# Altium project ISEPIC Cartridge for C64.PrjPcb
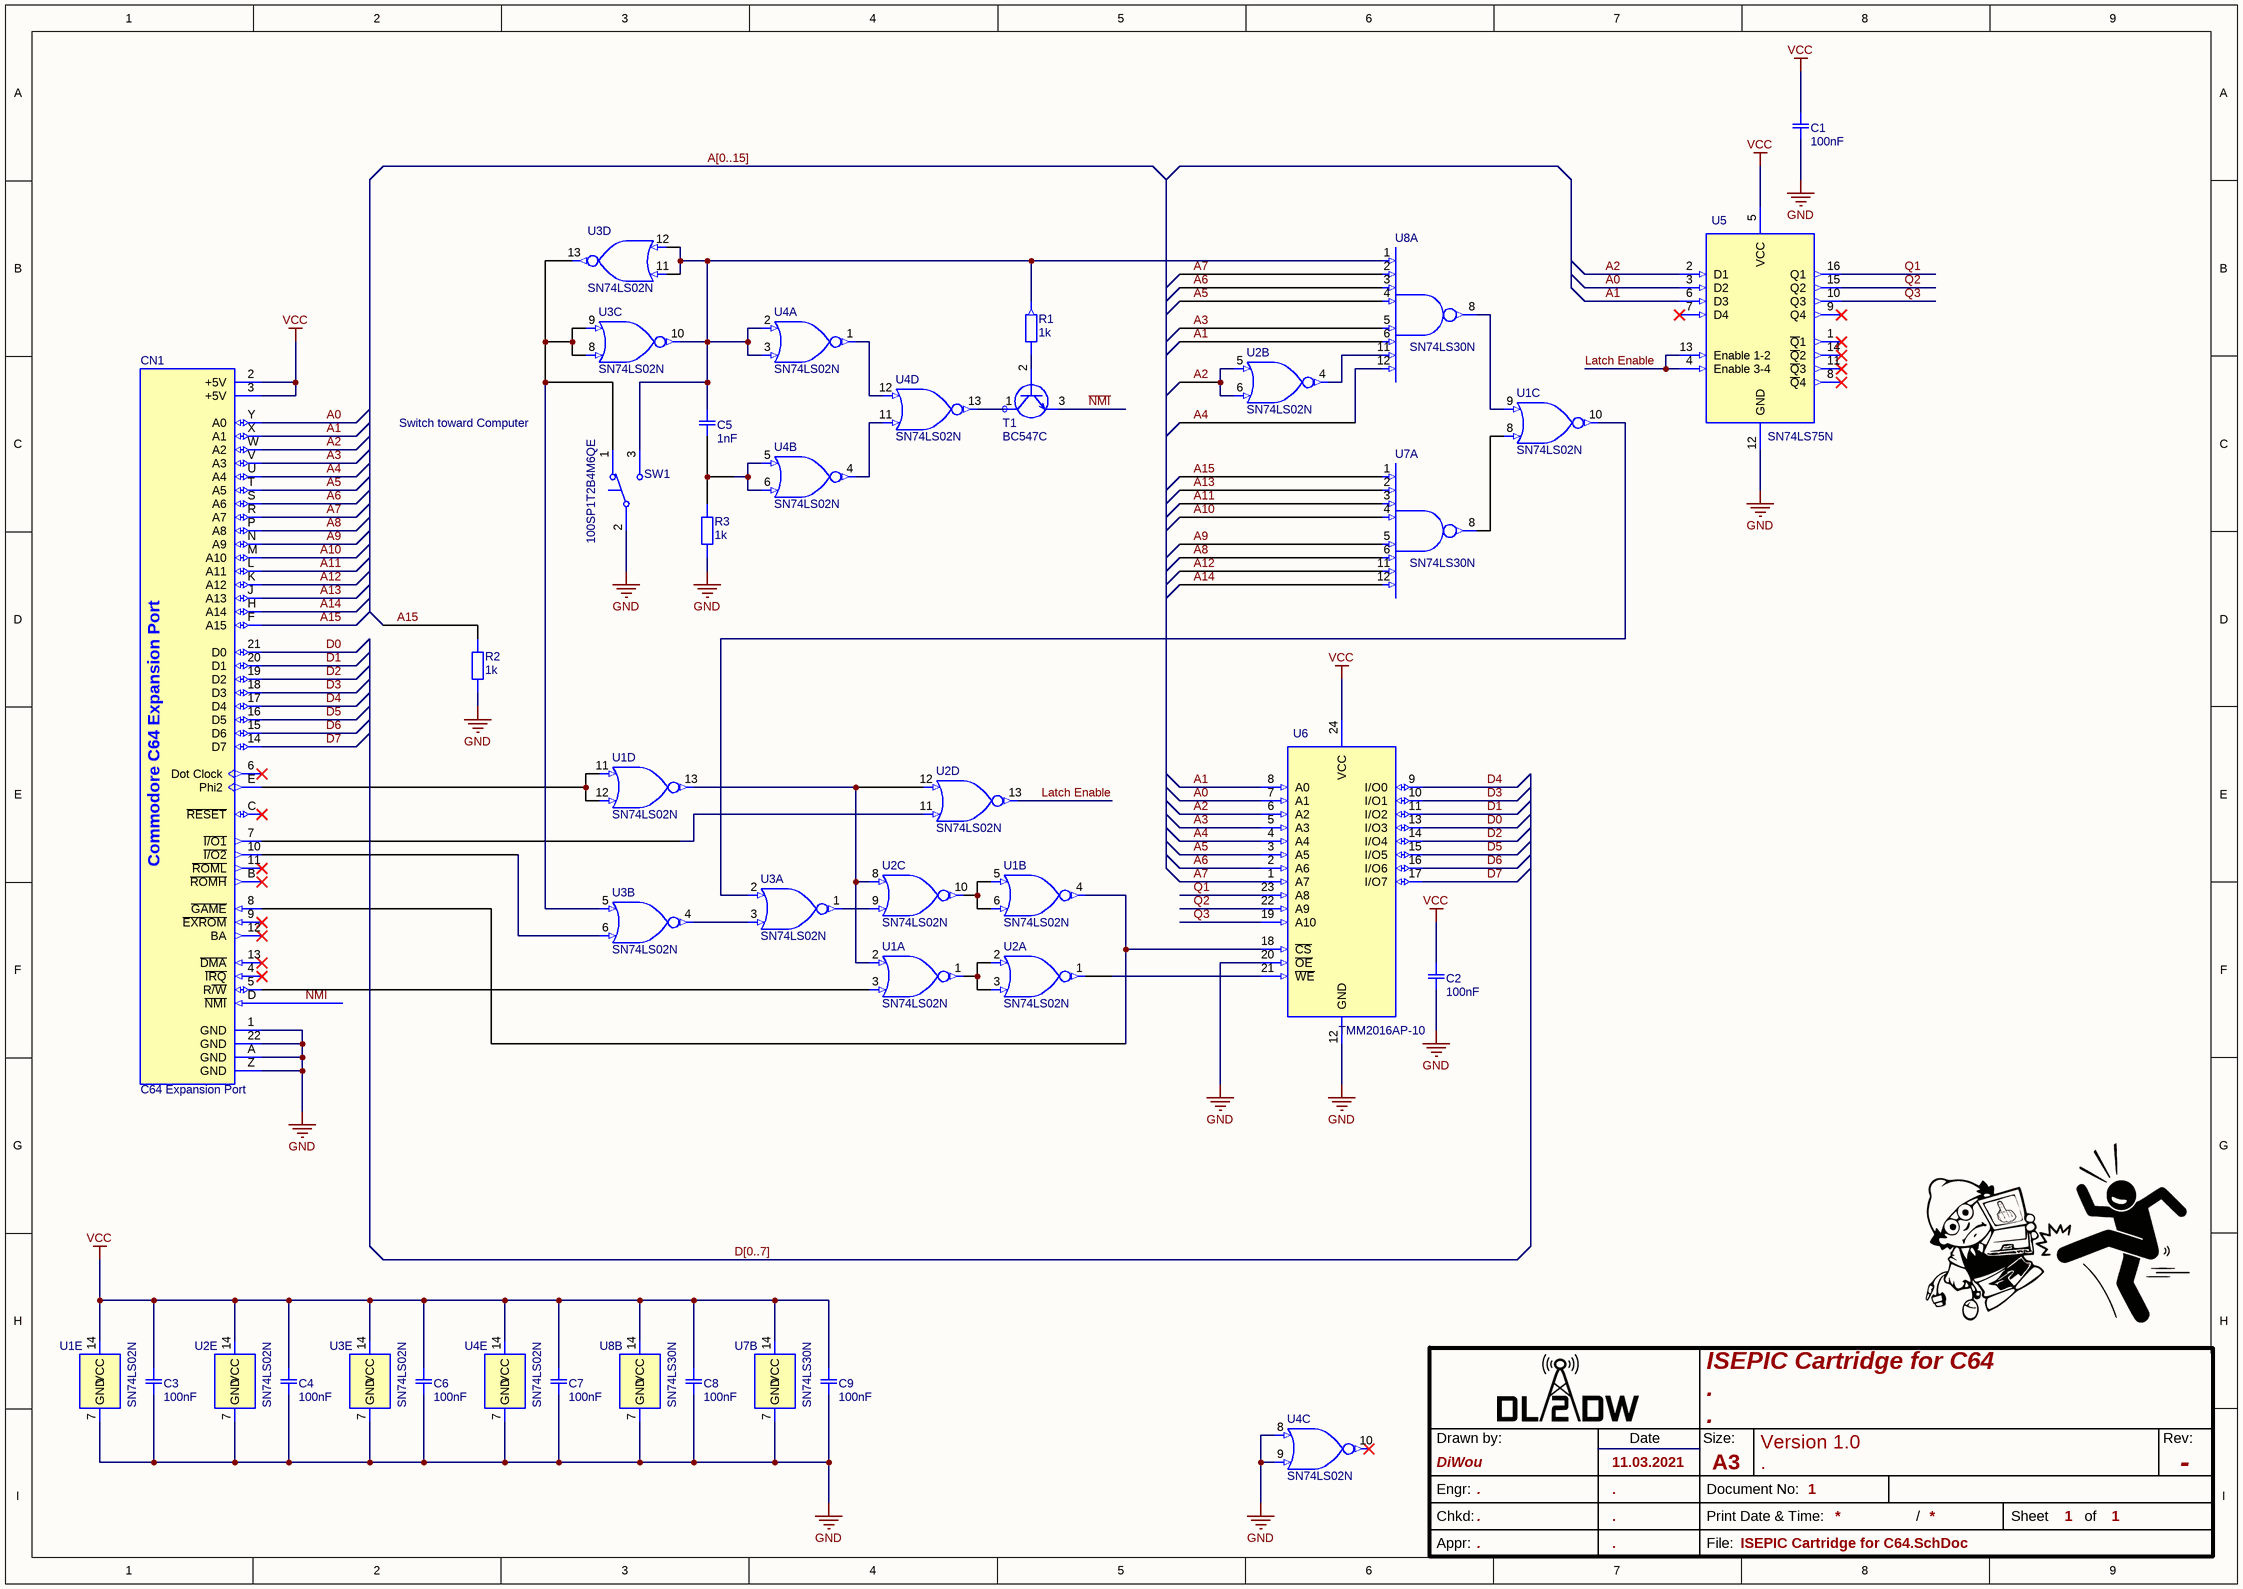
[diagram p0: ISEPIC Cartridge for C64.SchDoc]
Version: 1.0; Title: Projektname; Revision: a; Author: PCB-Tech
1 sheet, 23 parts. Net scope: global (net labels, ports and power ports of the same name join across sheets).
Board file: ISEPIC Cartridge for C64.PcbDoc

## Sheet ISEPIC Cartridge for C64.SchDoc: Projektname
size 420 x 297 mm; ApprovedBy: .; CheckedBy: .; Author: DiWou; CompanyName: DL2DW; DrawnBy: DiWou; Engineer: .; Organization: DL2DW; DocumentNumber: 1; Revision: -; SheetNumber: 1; SheetTotal: 1; DrawnDate: 11.03.2021; EngrDate: .; ChkdDate: .; Title1: ISEPIC Cartridge for C64; Title2: .; Title3: .; Desc1: Version 1.0; Desc2: .; ApprDate: .

### Parts
C1  100nF  [CAP Disc 100nF P2.54mm D5.5mm T3mm]
C2  100nF  [CAP Disc 100nF P2.54mm D5.5mm T3mm]
C3  100nF  [CAP Disc 100nF P2.54mm D5.5mm T3mm]
C4  100nF  [CAP Disc 100nF P2.54mm D5.5mm T3mm]
C5  1nF  [K102J15C0GF5TL2]
C6  100nF  [CAP Disc 100nF P2.54mm D5.5mm T3mm]
C7  100nF  [CAP Disc 100nF P2.54mm D5.5mm T3mm]
C8  100nF  [CAP Disc 100nF P2.54mm D5.5mm T3mm]
C9  100nF  [CAP Disc 100nF P2.54mm D5.5mm T3mm]
CN1  C64 Expansion Port  [C64 Expansion Port EDGE Connector]  (no BOM)
R1  1k  [1,0 kOhm R Axial DIN0207 L6.3mm D2.5mm P7.62mm Horizontal]
R2  1k  [1,0 kOhm R Axial DIN0207 L6.3mm D2.5mm P7.62mm Horizontal]
R3  1k  [1,0 kOhm R Axial DIN0207 L6.3mm D2.5mm P7.62mm Horizontal]
SW1  100SP1T2B4M6QE  [Toogle Switch SPDT 100SP1T2B4M6QE]
T1  BC547C  [BC547C]
U1  SN74LS02N  [SN74LS02N with Socket]  (parts A,B,C,D,E of 5)
U2  SN74LS02N  [SN74LS02N with Socket]  (parts A,B,C,D,E of 5)
U3  SN74LS02N  [SN74LS02N with Socket]  (parts A,B,C,D,E of 5)
U4  SN74LS02N  [SN74LS02N with Socket]  (parts A,B,C,D,E of 5)
U5  SN74LS75N  [SN74LS75N with Socket]
U6  TMM2016AP-10  [Toshiba TMM2016AP-10 - with Socket]
U7  SN74LS30N  [SN74LS30N with Socket]  (parts A,B of 2)
U8  SN74LS30N  [SN74LS30N with Socket]  (parts A,B of 2)

### Nets
GND: C1.1 C2.1 C3.1 C4.1 C6.1 C7.1 C8.1 C9.1 CN1.1(GND) CN1.22(GND) CN1.A(GND) CN1.Z(GND) R2.2 R3.1 SW1.2 U1.7(GND) U2.7(GND) U3.7(GND) U4.7(GND) U4.8(3A) U4.9(3B) U5.12(GND) U6.12(GND) U6.20(~{OE}) U7.7(GND) U8.7(GND)
VCC: C1.2 C2.2 C3.2 C4.2 C6.2 C7.2 C8.2 C9.2 CN1.2(+5V) CN1.3(+5V) U1.14(VCC) U2.14(VCC) U3.14(VCC) U4.14(VCC) U5.5(VCC) U6.24(VCC) U7.14(VCC) U8.14(VCC)
A0: CN1.Y(A0) U5.3(D2) U6.7(A1)
A1: CN1.X(A1) U5.6(D3) U6.8(A0) U8.6(F)
A2: CN1.W(A2) U2.5(2A) U2.6(2B) U5.2(D1) U6.6(A2)
A3: CN1.V(A3) U6.5(A3) U8.5(E)
A4: CN1.U(A4) U6.4(A4) U8.12(H)
A5: CN1.T(A5) U6.3(A5) U8.4(D)
A6: CN1.S(A6) U6.2(A6) U8.3(C)
A7: CN1.R(A7) U6.1(A7) U8.2(B)
A8: CN1.P(A8) U7.6(F)
A9: CN1.N(A9) U7.5(E)
A10: CN1.M(A10) U7.4(D)
A11: CN1.L(A11) U7.3(C)
A12: CN1.K(A12) U7.11(F)
A13: CN1.J(A13) U7.2(B)
A14: CN1.H(A14) U7.12(H)
A15: CN1.F(A15) R2.1 U7.1(A)
D0: CN1.21(D0) U6.13(I/O3)
D1: CN1.20(D1) U6.11(I/O2)
D2: CN1.19(D2) U6.14(I/O4)
D3: CN1.18(D3) U6.10(I/O1)
D4: CN1.17(D4) U6.9(I/O0)
D5: CN1.16(D5) U6.15(I/O5)
D6: CN1.15(D6) U6.16(I/O6)
D7: CN1.14(D7) U6.17(I/O7)
Latch Enable: U2.13(4Y) U5.4(Enable_3-4) U5.13(Enable_1-2)
~{NMI}: CN1.D(~{NMI}) T1.3
Q1: U5.16(Q1) U6.23(A8)
Q2: U5.15(Q2) U6.22(A9)
Q3: U5.10(Q3) U6.19(A10)
NetC5_1: C5.1 R1.2 SW1.3 U3.10(3Y) U3.11(4A) U3.12(4B) U4.2(1A) U4.3(1B) U8.1(A)
NetC5_2: C5.2 R3.2 U4.5(2A) U4.6(2B)
NetCN1_5: CN1.5(R~{/W}) U1.3(1B)
NetCN1_7: CN1.7(~{I/O1}) U2.11(4A)
NetCN1_8: CN1.8(~{GAME}) U1.4(2Y) U6.18(~{CS})
NetCN1_10: CN1.10(~{I/O2}) U3.6(2B)
NetCN1_E: CN1.E(Phi2) U1.11(4A) U1.12(4B)
NetR1_1: R1.1 T1.2
NetSW1_1: SW1.1 U3.5(2A) U3.8(3A) U3.9(3B) U3.13(4Y)
NetT1_1: T1.1 U4.13(4Y)
NetU1_1: U1.1(1Y) U2.2(1A) U2.3(1B)
NetU1_2: U1.2(1A) U1.13(4Y) U2.8(3A) U2.12(4B)
NetU1_5: U1.5(2A) U1.6(2B) U2.10(3Y)
NetU1_8: U1.8(3A) U7.8(1Y)
NetU1_9: U1.9(3B) U8.8(1Y)
NetU1_10: U1.10(3Y) U3.2(1A)
NetU2_1: U2.1(1Y) U6.21(~{WE})
NetU2_4: U2.4(2Y) U8.11(F)
NetU2_9: U2.9(3B) U3.1(1Y)
NetU3_3: U3.3(1B) U3.4(2Y)
NetU4_1: U4.1(1Y) U4.12(4B)
NetU4_4: U4.4(2Y) U4.11(4A)

Not connected (* = marked no-connect by the designer): CN1 4(~{IRQ})* 6(Dot_Clock)* 9(~{EXROM})* 11(~{ROML})* 12(BA)* 13(~{DMA})* B(~{ROMH})* C(~{RESET})*; U4 10(3Y)*; U5 1(~{Q}1)* 7(D4)* 8(~{Q}4)* 9(Q4)* 11(~{Q}3)* 14(~{Q}2)*; U7 9(N/C) 10(N/C) 13(N/C); U8 9(N/C) 10(N/C) 13(N/C)

### Buses and harness runs
bus A[0..15]
bus D[0..7]

### Notes on the sheet
- Switch toward Computer
- Drawn by:
- Date
- Size:
- A3
- Rev:
- Engr:
- Chkd:
- Appr:
- File:
- Document No:
- Print Date & Time:
- /
- Sheet
- of
- (in symbol CMP-Commodore-00008-4) Commodore C64 Expansion Port

### Library data of the parts
C1-C4 C6-C9 = CMP-Capacitors-Ceramic_Capacitors-00007-4: Ceramic Disc Capacitors 100nF -20%~+80% 50V Through Hole,P=2.54mm RoHS; ComponentLink1URL: https://lcsc.com/product-detail/Others_Dersonic-CC1H104ZA1PD3F5O3000_C353909.html
C5 = CMP-Capacitors-Ceramic_Capacitors-00026-2: CAP CER 1000PF 50V C0G/NP0 RAD; Lead Length: 30mm; Tolerance: 5%; Dielectric: C0G; Lead/Base Style: Straight; Length: 4mm; Height: 4mm; Max Operating Temperature: 125°C; Height - Seated (Max): 0.22inch; Package Quantity: 1; Termination: Radial; Depth: 2.6mm; Packaging: Tape and Reel; Voltage Rating (DC): 50V; Lead Pitch: 0.098inch; Voltage Rating: 50V; Radiation Hardening: No; Min Operating Temperature: -55°C; Mount: Through Hole,PCB; Lead Free: Lead Free; Case/Package: Dipped; Width: 0.098inch; Voltage: 50V; Capacitance: 1nF
CN1 = CMP-Commodore-00008-4: Expansion Port EDGE Connector for Interface Cards
R1-R3 = CMP-Resistors-Yageo_THT_DIN_0207-00072-1: RES 1K OHM 1/4W 5% AXIAL; Max Power Dissipation: 250mW; Resistance: 1kR; Temperature Coefficient: 500ppm/°C; Composition: Carbon Film; Lead Free: Lead Free; Case/Package: Axial; Packaging: Bulk; Length: 0.248inch; Min Operating Temperature: -55°C; Tolerance: 5%; Number of Terminations: 2; Package Quantity: 200; Max Operating Temperature: 155°C; Power Rating: 250mW
SW1 = CMP-Switches-00009-1: SWITCH TOGGLE SPDT 5A 120V; Switch Function: On-On; Actuator Material: Brass,Chrome; Contact Resistance: 100mR; Actuator Color: Chrome; Max Voltage Rating (DC): 28V; Actuator Length: 6.46mm; Actuator Type: Standard Round; Max Voltage Rating (AC): 250V; Electrical Life: 40000Cycles; Illumination Type: Non-Illuminated,Illuminated; Termination: PC Pin; Packaging: Bulk; RoHS Compliant: Yes; Mount: Through Hole,Brackets; Length: 12.7mm; Max Operating Temperature: 85°C; Contact Material: Silver,Copper Alloy; Housing Material: Stainless Steel; Orientation: Right Angle; Current Rating: 5A; Contact Plating: Silver; Series: 100; Voltage Rating (AC): 120V; Throw Configuration: SPDT; Min Operating Temperature: -30°C; Width: 6.86mm; Voltage Rating (DC): 28V; Lead Free: Lead Free; Package Quantity: 1
T1 = CMP-Transistors-00002-3: BC547C Diotec Bipolar NPN Transistor 45V; Collector Base Voltage (VCBO): 50V; Frequency: 300MHz; Power Dissipation: 500mW; Number of Elements: 1; Emitter Base Voltage (VEBO): 5V; Collector Emitter Saturation Voltage: 600mV; Max Operating Temperature: 150°C; Number of Channels: 1; Number of Pins: 3; Polarity: NPN; Collector Emitter Voltage (VCEO): 45V; Mount: Through Hole; Packaging: Tape and Reel; Min Operating Temperature: -55°C; Case/Package: TO-92
U1-U4 = CMP-ICs-74xx-series-00003-3: IC GATE NOR 4CH 2-INP 14DIP; High Level Output Current: -400uA; Number of Bits: 4; Output Current: 8mA; Min Supply Voltage: 4.75V; Turn-On Delay Time: 15ns; Number of Output Lines: 1; Max Supply Voltage: 5.25V; Number of Inputs: 2; Quiescent Current: 2.8mA; Schmitt Trigger Input: No; Operating Supply Voltage: 5V; Max Operating Temperature: 70°C; Height: 4.57mm; Contact Plating: Gold; Number of Pins: 14; Lead Free: Lead Free; Termination: Through Hole; REACH SVHC: No SVHC; Package Quantity: 25; Propagation Delay: 15ns; Radiation Hardening: No; Number of Gates: 4; Number of Elements: 4; Min Operating Temperature: 0°C; Width: 6.35mm; Number of Outputs: 1; Mount: Through Hole; Number of Input Lines: 2; Case/Package: PDIP; Weight: 0.032734oz; Number of Circuits: 4; Length: 19.3mm; Packaging: Rail/Tube; Low Level Output Current: 8mA; Max Output Current: 8mA; Logic Function: NOR
U5 = CMP-ICs-74xx-series-00080-1: Latch Transparent 4-CH D-Type 16-Pin PDIP Tube; Operating Supply Voltage: 5V; Number of Bits: 4; Logic Function: D-Type,Latch; Propagation Delay: 27ns; Polarity: Non-Inverting; Turn-On Delay Time: 9ns; Quiescent Current: 6.3mA; Min Supply Voltage: 4.75V; Number of Circuits: 2; Low Level Output Current: 8mA; Nominal Supply Current: 12mA; High Level Output Current: -400uA; Max Supply Voltage: 5.25V; REACH SVHC: No SVHC; Package Quantity: 25; Lead Free: Contains Lead; Length: 19.3mm; Case/Package: PDIP; Height: 4.57mm; Number of Output Lines: 4; Min Operating Temperature: 0°C; Max Operating Temperature: 70°C; Contact Plating: Gold; Packaging: Rail/Tube; Independent Circuits: 4; Number of Elements: 2; Number of Pins: 16; Number of Input Lines: 4; Weight: 0.03357oz; Output Current: 8mA; Mount: Through Hole; Width: 6.35mm; Radiation Hardening: No
U6 = CMP-ICs-Memory-00000-4: Integrated Circuit Memory 2016/TMM2016AP10 TOSHIBA Static RAM memory prog. volatille KX8=2
U7 U8 = CMP-ICs-74xx-series-00029-2: IC GATE NAND 1CH 8-INP 14DIP; High Level Output Current: -16mA; Low Level Output Current: 400uA; Propagation Delay: 20ns; Number of Elements: 1; Turn-On Delay Time: 22ns; Nominal Supply Current: 100uA; Number of Input Lines: 8; Output Current: 8mA; Max Supply Voltage: 5.25V; Operating Supply Voltage: 5V; Min Supply Voltage: 4.75V; Mount: Through Hole; Weight: 0.032734oz; Case/Package: PDIP; Packaging: Rail/Tube; Contact Plating: Gold; Radiation Hardening: No; Max Operating Temperature: 70°C; Number of Circuits: 1; Number of Gates: 1; Number of Outputs: 1; Logic Function: NAND; Number of Bits: 1; REACH SVHC: No SVHC; Termination: Through Hole; Min Operating Temperature: 0°C; Number of Inputs: 8; Lead Free: Lead Free; Number of Pins: 14; Package Quantity: 25; Max Output Current: 8mA; Number of Output Lines: 1